# EAGLE schematic ESP32-S3-WROOM-1-N8 (EAGLE 9.6.2)
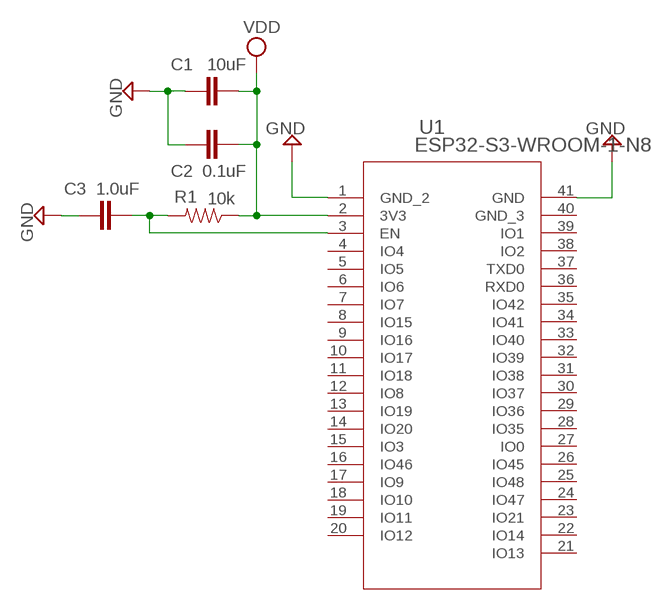
[diagram p0: schematic, sheet 1]

## Parts
C1  10uF  10UF-0402T-6.3V-20%  [0402-TIGHT]
C2  0.1uF  0.1UF-0402T-6.3V-10%-X7R  [0402-TIGHT]
C3  1.0uF  1.0UF-0402T-16V-10%  [0402-TIGHT]
R1  10k  10KOHM-0402-1/16W-1%  [0402]
U1  ESP32-S3-WROOM-1-N8  [ESP32-S3-WROOM-1-N8_EXP]

## Nets
GND: C1.1 C2.1 C3.1 U1.1(GND_2) U1.41(GND)
N$1: C3.2 R1.2 U1.3(EN)
VDD: C1.2 C2.2 R1.1 U1.2(3V3)
Unconnected: U1.4(IO4) U1.5(IO5) U1.6(IO6) U1.7(IO7) U1.8(IO15) U1.9(IO16) U1.10(IO17) U1.11(IO18) U1.12(IO8) U1.13(IO19) U1.14(IO20) U1.15(IO3) U1.16(IO46) U1.17(IO9) U1.18(IO10) U1.19(IO11) U1.20(IO12) U1.21(IO13) U1.22(IO14) U1.23(IO21) U1.24(IO47) U1.25(IO48) U1.26(IO45) U1.27(IO0) U1.28(IO35) U1.29(IO36) U1.30(IO37) U1.31(IO38) U1.32(IO39) U1.33(IO40) U1.34(IO41) U1.35(IO42) U1.36(RXD0) U1.37(TXD0) U1.38(IO2) U1.39(IO1) U1.40(GND_3)

## Library data of the parts
C1 = SparkFun-Capacitors:10UF: 10.0µF ceramic capacitors A capacitor is a passive two-terminal electrical component used to store electrical energy temporarily in an electric field.; PROD_ID: CAP-14848
C2 = SparkFun-Capacitors:0.1UF: 0.1µF ceramic capacitors A capacitor is a passive two-terminal electrical component used to store electrical energy temporarily in an electric field.; PROD_ID: CAP-14993
C3 = SparkFun-Capacitors:1.0UF: 1µF ceramic capacitors A capacitor is a passive two-terminal electrical component used to store electrical energy temporarily in an electric field.; PROD_ID: CAP-12417
R1 = SparkFun-Resistors:10KOHM: 10kΩ resistor A resistor is a passive two-terminal electrical component that implements electrical resistance as a circuit element. Resistors act to reduce current flow, and, at the same time, act to lower voltage levels within circuits. - Wikipedia; PROD_ID: RES-14241
U1 = ESP32-S3-WROOM-1-N8:ESP32-S3-WROOM-1-N8; COPYRIGHT: Copyright (C) 2022 Ultra Librarian. All rights reserved.; DIGI-KEY_PART_NUMBER_1: 1965-ESP32-S3-WROOM-1-N8TR-ND; DIGI-KEY_PART_NUMBER_2: 1965-ESP32-S3-WROOM-1-N8CT-ND; DIGI-KEY_PART_NUMBER_3: 1965-ESP32-S3-WROOM-1-N8DKR-ND; MANUFACTURER_PART_NUMBER: ESP32-S3-WROOM-1-N8; MFR_NAME: Espressif Systems